# EAGLE design buffered input 11-4-21-fix (EAGLE 9.6.2)
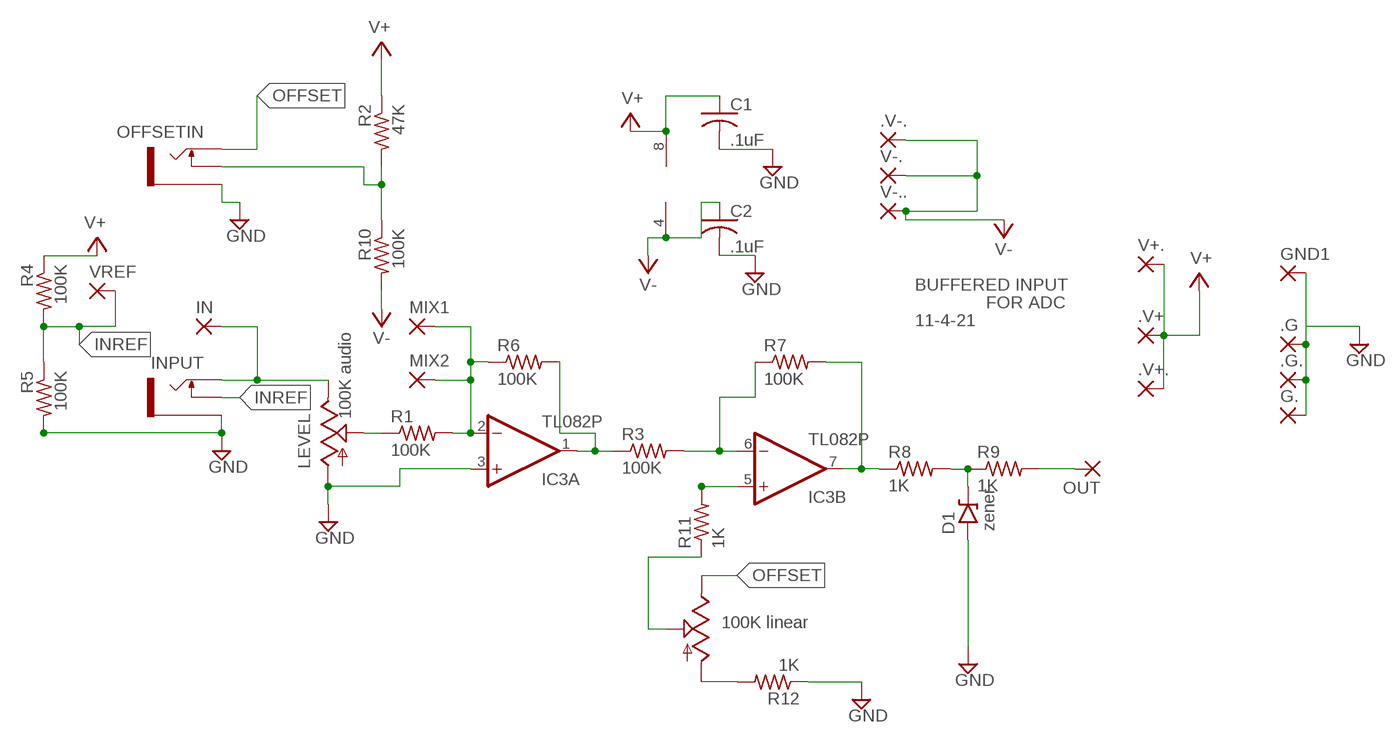
[diagram p0: schematic, sheet 1]

## Parts
.G  3,17/1,3  [3,17/1,3]
.G.  3,17/1,3  [3,17/1,3]
.V+  2,54/1,0  [2,54/1,0]
.V+.  2,54/1,0  [2,54/1,0]
.V-.  3,17/1,3  [3,17/1,3]
C1  .1uF  C-US025-025X050  [C025-025X050]
C2  .1uF  C-US025-025X050  [C025-025X050]
D1  zener  ZENER.2  [DO41-2]
G.  3,17/1,3  [3,17/1,3]
GND1  3,17/1,3  [3,17/1,3]
IC3  TL082P  [DIL08]
IN  3,17/1,3  [3,17/1,3]
INPUT  THONKICONNNEW  [WQP-PJ301M-12_JACK]
LEVEL  100K audio  9MM_SNAP-IN_POT_  [9MM_SNAP-IN_POT]
MIX1  3,17/1,3  [3,17/1,3]
MIX2  3,17/1,3  [3,17/1,3]
OFFSET  100K linear  9MM_SNAP-IN_POT_  [9MM_SNAP-IN_POT]
OFFSETIN  THONKICONNNEW  [WQP-PJ301M-12_JACK]
OUT  3,17/1,3  [3,17/1,3]
R1  100K  R-US_0204/7  [0204/7]
R2  47K  R-US_0204/7  [0204/7]
R3  100K  R-US_0204/7  [0204/7]
R4  100K  R-US_0204/7  [0204/7]
R5  100K  R-US_0204/7  [0204/7]
R6  100K  R-US_0204/7  [0204/7]
R7  100K  R-US_0204/7  [0204/7]
R8  1K  R-US_0204/7  [0204/7]
R9  1K  R-US_0204/7  [0204/7]
R10  100K  R-US_0204/7  [0204/7]
R11  1K  R-US_0204/7  [0204/7]
R12  1K  R-US_0204/7  [0204/7]
V+.  2,54/1,0  [2,54/1,0]
V-.  3,17/1,3  [3,17/1,3]
V-..  3,17/1,3  [3,17/1,3]
VREF  3,17/1,3  [3,17/1,3]

## Nets
CHARREF: OFFSETIN.P$2_SWITCH(SWITCH) R2.2 R10.1
GND: .G.1(P) .G..1(P) C1.2 C2.2 D1.A G..1(P) GND1.1(P) IC3.3(A:+IN) INPUT.P$3_SLEEVE(SLEEVE) LEVEL.1(A) OFFSETIN.P$3_SLEEVE(SLEEVE) R5.2 R12.1
INREF: INPUT.P$2_SWITCH(SWITCH) R4.2 R5.1 VREF.1(P)
N$1: IN.1(P) INPUT.P$1_TIP(TIP) LEVEL.3(E)
N$2: OUT.1(P) R9.2
N$3: OFFSET.1(A) R12.2
N$4: IC3.5(B:+IN) R11.2
N$5: IC3.6(B:-IN) R3.2 R7.1
N$6: IC3.1(A:OUT) R3.1 R6.2
N$7: IC3.2(A:-IN) MIX1.1(P) MIX2.1(P) R1.2 R6.1
N$8: LEVEL.2(S) R1.1
N$9: OFFSET.2(S) R11.1
N$13: IC3.7(B:OUT) R7.2 R8.1
N$14: D1.C R8.2 R9.1
OFFSET: OFFSET.3(E) OFFSETIN.P$1_TIP(TIP)
V+: .V+.1(P) .V+..1(P) C1.1 IC3.8(P:V+) R2.1 R4.1 V+..1(P)
V-: .V-..1(P) C2.1 IC3.4(P:V-) R10.2 V-..1(P) V-...1(P)

## Notes on the sheet
- BUFFERED INPUT
- FOR ADC
- 11-4-21

## Library data of the parts
.G .G. G. GND1 IN MIX1 MIX2 OUT VREF = wirepad:3,17/1,3: THROUGH-HOLE PAD
.V+ .V+. V+. = wirepad-NONAMES:2,54/1,0: THROUGH-HOLE PAD
.V-. V-. V-.. = wirepad-NONAMES:3,17/1,3: THROUGH-HOLE PAD
C1 C2 = adafruit:C-US: CAPACITOR, American symbol
D1 = diodes:ZENER
IC3 = linear:TL082: OP AMP Data sheet <http://www.ti.com/lit/ds/symlink/tl084a . pdf>; DATA_SHEET: <a href="http://www.ti.com/lit/ds/symlink/tl084a.pdf"> Data sheet </a>
INPUT OFFSETIN = MusicThingModular:THONKICONN: 3.5mm socket for Eurorack modular synths
LEVEL OFFSET = MusicThingModular-CL:9MM_SNAP-IN_POT: 9mm vertical snap-in pot, Alpha / Panasonic style
R1-R12 = rcl:R-US_: RESISTOR, American symbol

## Board
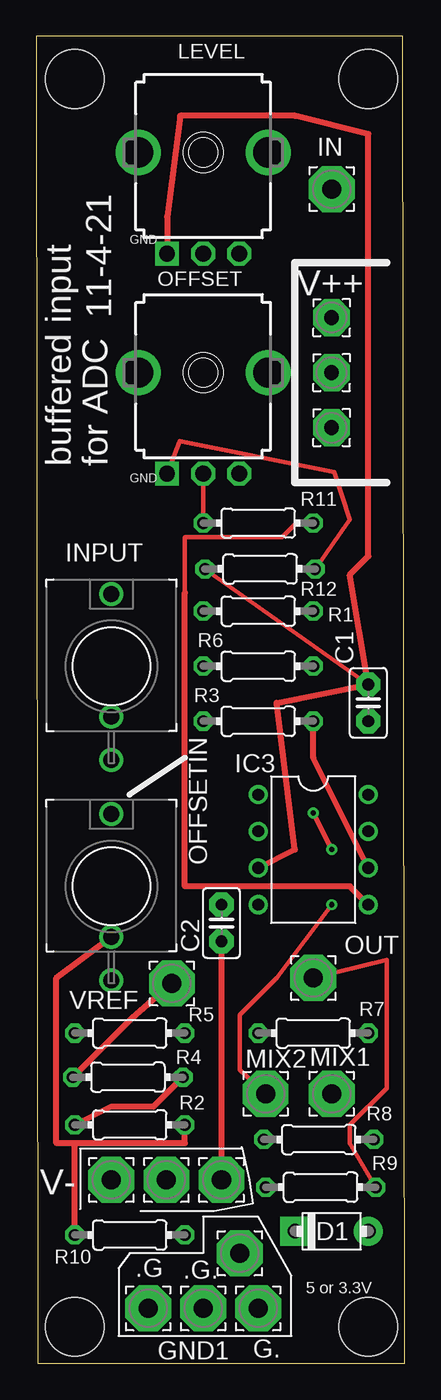
[diagram p1: board, top side]
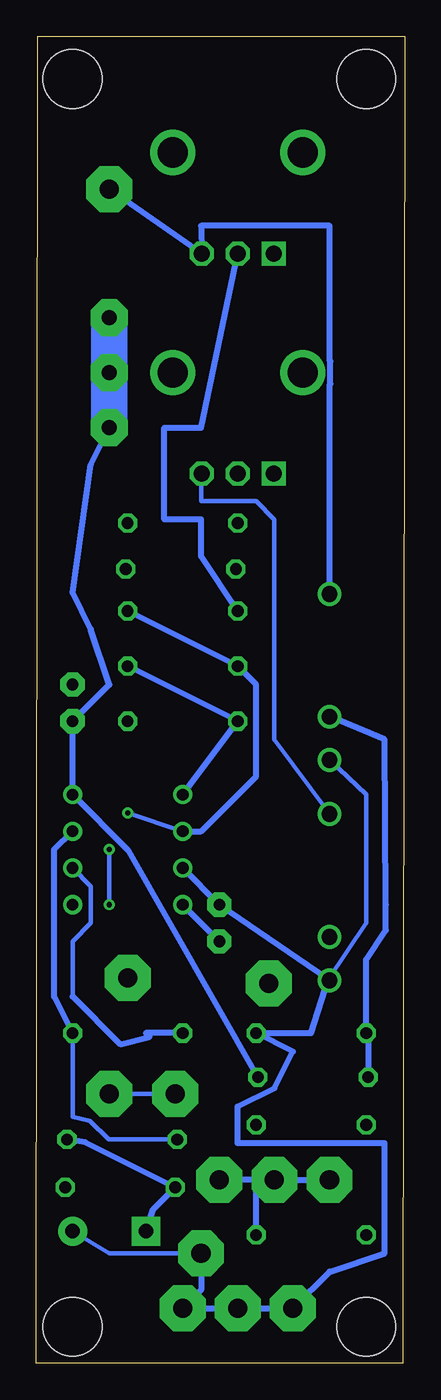
[diagram p2: board, bottom side, seen from below]

Size 25.51 x 91.87 mm. Coordinates in mm from the lower left corner, seen from the top.
Outline: 0.13,0 25.51,0 25.38,91.87 0,91.87 0.13,0
Copper layers (1*16): Top 0.035mm / dielectric 1.5mm / Bottom 0.035mm
Design rules "default": minimum track width 6mil, minimum drill 0.35mm, track to track 6mil, track to pad 6mil, pad to pad 6mil, via to via 6mil, smd to smd 6mil, copper to edge 40mil, drill to drill 6mil, minimum pad ring 10mil, minimum via ring 8mil, stop-mask expansion 4mil, vias tented up to drill 0mil, thermal gap 10mil
Holes 4.06 mm at 22.99,88.9 2.67,88.9 2.67,2.54 22.99,2.54

### Footprints (pad centres in the part's own frame; a part is rotated, then mirrored left to right if it is on the bottom)
3,17/1,3 = drill 1.321 pad 3.175 octagon: 1 0,0
2,54/1,0 = drill 1.016 pad 2.54 octagon: 1 0,0
C025-025X050 = drill 0.813 pad 1.676 octagon: 1 -1.27,0; 2 1.27,0
DO41-2 = drill 1 pad 2: A 2.54,0 | drill 1 pad 2 square: C -2.54,0
DIL08 = drill 0.813 pad 1.27: 1 -3.81,-3.81; 2 -1.27,-3.81; 3 1.27,-3.81; 4 3.81,-3.81; 5 3.81,3.81; 6 1.27,3.81; 7 -1.27,3.81; 8 -3.81,3.81
WQP-PJ301M-12_JACK = drill 1.1: P$1_TIP 0,5; P$2_SWITCH 0,-3.5; P$3_SLEEVE 0,-6.5
9MM_SNAP-IN_POT = drill 1.1 square: 1 -2.5,-7 | drill 1.1 octagon: 2 0,-7; 3 2.5,-7 | drill 2.1 pad 2.794: CHASSIS1 -4.5,0; CHASSIS2 4.5,0
0204/7 = drill 0.813 octagon: 1 -3.81,0; 2 3.81,0

### Placement (x,y rotation side)
.G  7.75,3.81 0 top
.G.  14.1,7.62 0 top
.V+  20.45,72.39 0 top
.V+.  20.45,68.58 0 top
.V-.  12.83,12.7 0 top
C1  22.99,45.72 90 top
C2  12.83,30.48 90 top
D1  20.45,9.14 0 top
G.  15.37,3.81 0 top
GND1  11.56,3.81 0 top
IC3  19.18,35.56 270 top
IN  20.45,81.28 0 top
INPUT  5.21,48.26 0 top
LEVEL  11.56,83.82 0 top
MIX1  20.45,18.67 0 top
MIX2  15.88,18.67 0 top
OFFSET  11.56,68.58 0 top
OFFSETIN  5.21,33.02 0 top
OUT  19.18,26.67 0 top
R1  15.37,52.07 0 top
R2  6.48,16.51 0 top
R3  15.37,44.45 0 top
R4  6.35,19.81 180 top
R5  6.48,22.86 0 top
R6  15.37,48.26 0 top
R7  19.18,22.86 0 top
R8  19.56,15.49 0 top
R9  19.68,12.19 0 top
R10  6.48,8.89 0 top
R11  15.37,58.17 0 top
R12  15.49,54.99 0 top
V+.  20.45,64.77 0 top
V-.  5.21,12.7 0 top
V-..  9.02,12.7 0 top
VREF  9.4,26.29 0 top

### Tracks (layer width: path | path; a pad name or v marks a point on that pad's centre or on a via)
CHARREF
  Top 0.406: R10.1 2.67,15.24 | 2.67,15.24 10.29,15.24 R2.2 | 2.67,15.24 1.4,15.24 1.4,26.67 OFFSETIN.P$2_SWITCH
GND
  Top 0.305: C1.2 R12.1
  Top 0.406: IC3.3 17.91,35.56 16.64,45.72 C1.2 21.72,54.61 22.99,55.88 22.99,85.09 17.91,86.36 9.96,86.36 9.06,79.36 LEVEL.1
  Bottom 0.305: INPUT.P$3_SLEEVE 2.67,39.37 2.67,30.48 5.28,26.57 | .G..1 20.45,7.62 D1.A
  Bottom 0.406: .G..1 14.1,5.08 G..1 GND1.1 .G.1 5.21,6.35 1.4,7.62 1.4,15.24 11.56,15.24 11.56,17.78 9.02,19.05 7.75,21.59 R5.2 6.48,22.86 5.28,26.57 | OFFSETIN.P$3_SLEEVE 5.28,26.57 | 5.28,26.57 C2.2 IC3.3
INREF
  Top 0.406: R4.2 6.62,23.89 VREF.1
  Bottom 0.406: R4.2 2.54,22.73 R5.1 2.67,27.94 1.3,29.98 1.3,31.75 1.4,43.18 INPUT.P$2_SWITCH
N$1
  Bottom 0.406: INPUT.P$1_TIP 5.21,67.72 5.14,67.79 5.14,69.37 5.21,69.44 5.21,78.74 14.1,78.74 LEVEL.3 IN.1
N$2
  Top 0.305: OUT.1 24.26,27.94 24.26,24.13 24.26,22.86 24.26,19.05 21.72,16.51 21.72,15.24 R9.2
N$3
  Top 0.305: R12.2 21.72,58.42 20.63,61.69 9.92,63.83 OFFSET.1
N$4
  Top 0.305: R11.2 18.07,58.24 17.04,57.2 10.34,57.2 10.29,57.15 10.29,53.34
  Top 0.406: IC3.5 21.72,33.02 10.29,33.02 10.29,53.34
N$5
  Top 0.406: IC3.6 19.18,41.91 R3.2
  Bottom 0.305: 22.99,25.4 22.99,29.21 21.72,30.48 21.72,33.02 IC3.6
  Bottom 0.406: R7.1 17.91,22.86 17.65,22.61 19.68,22.1 22.99,25.4
N$6
  Bottom 0.406: R6.2 R3.1 IC3.1
N$7  (via drill 0.35)
  Top 0.305: MIX2.1 14.1,20.32 14.1,24.13 16.64,26.67 v20.45,31.75 | v20.45,35.56 v19.18,38.1
  Bottom 0.305: MIX1.1 MIX2.1 | v20.45,31.75 v20.45,35.56 | v19.18,38.1 IC3.2
  Bottom 0.406: R1.2 R6.1 10.29,46.99 10.29,40.64 14.1,36.83 IC3.2
N$8
  Bottom 0.406: R1.1 14.1,55.88 14.1,58.42 16.64,58.42 16.64,64.77 14.1,64.77 LEVEL.2
N$9
  Top 0.305: R11.1 OFFSET.2
N$13
  Bottom 0.305: R8.1 20.5,15.49 21.81,16.8 22.99,17.06 R7.2
  Bottom 0.406: R7.2 24.26,25.4 24.26,35.56 IC3.7
N$14
  Bottom 0.406: D1.C 17.4,10.67 R9.1 22.12,15.32 R8.2
OFFSET
  Bottom 0.305: OFFSETIN.P$1_TIP 9.02,43.18 9.02,58.42 10.29,59.69 14.1,59.69 14.1,61.54 OFFSET.3
V+
  Top 0.406: R2.1 5.21,17.78 8.13,17.78 R4.1
  Bottom 0.406: R4.1 19.13,35.52 IC3.8 C1.1 20.45,46.99 21.72,50.8 22.99,53.34 21.72,62.23 V+..1
  Bottom 2.54: .V+.1 .V+..1 V+..1
V-
  Top 0.406: .V-..1 C2.1
  Bottom 0.406: V-..1 V-...1 10.29,12.7 | C2.1 IC3.4 | 10.29,12.7 .V-..1 | R10.2 10.29,12.7

### Text on the board
tNames: GND | V++ | 11-4-21 | buffered input | for ADC | GND | V- | 5 or 3.3V